# Altium schematic sheet NET & UART.SchDoc
size 393 x 281 mm
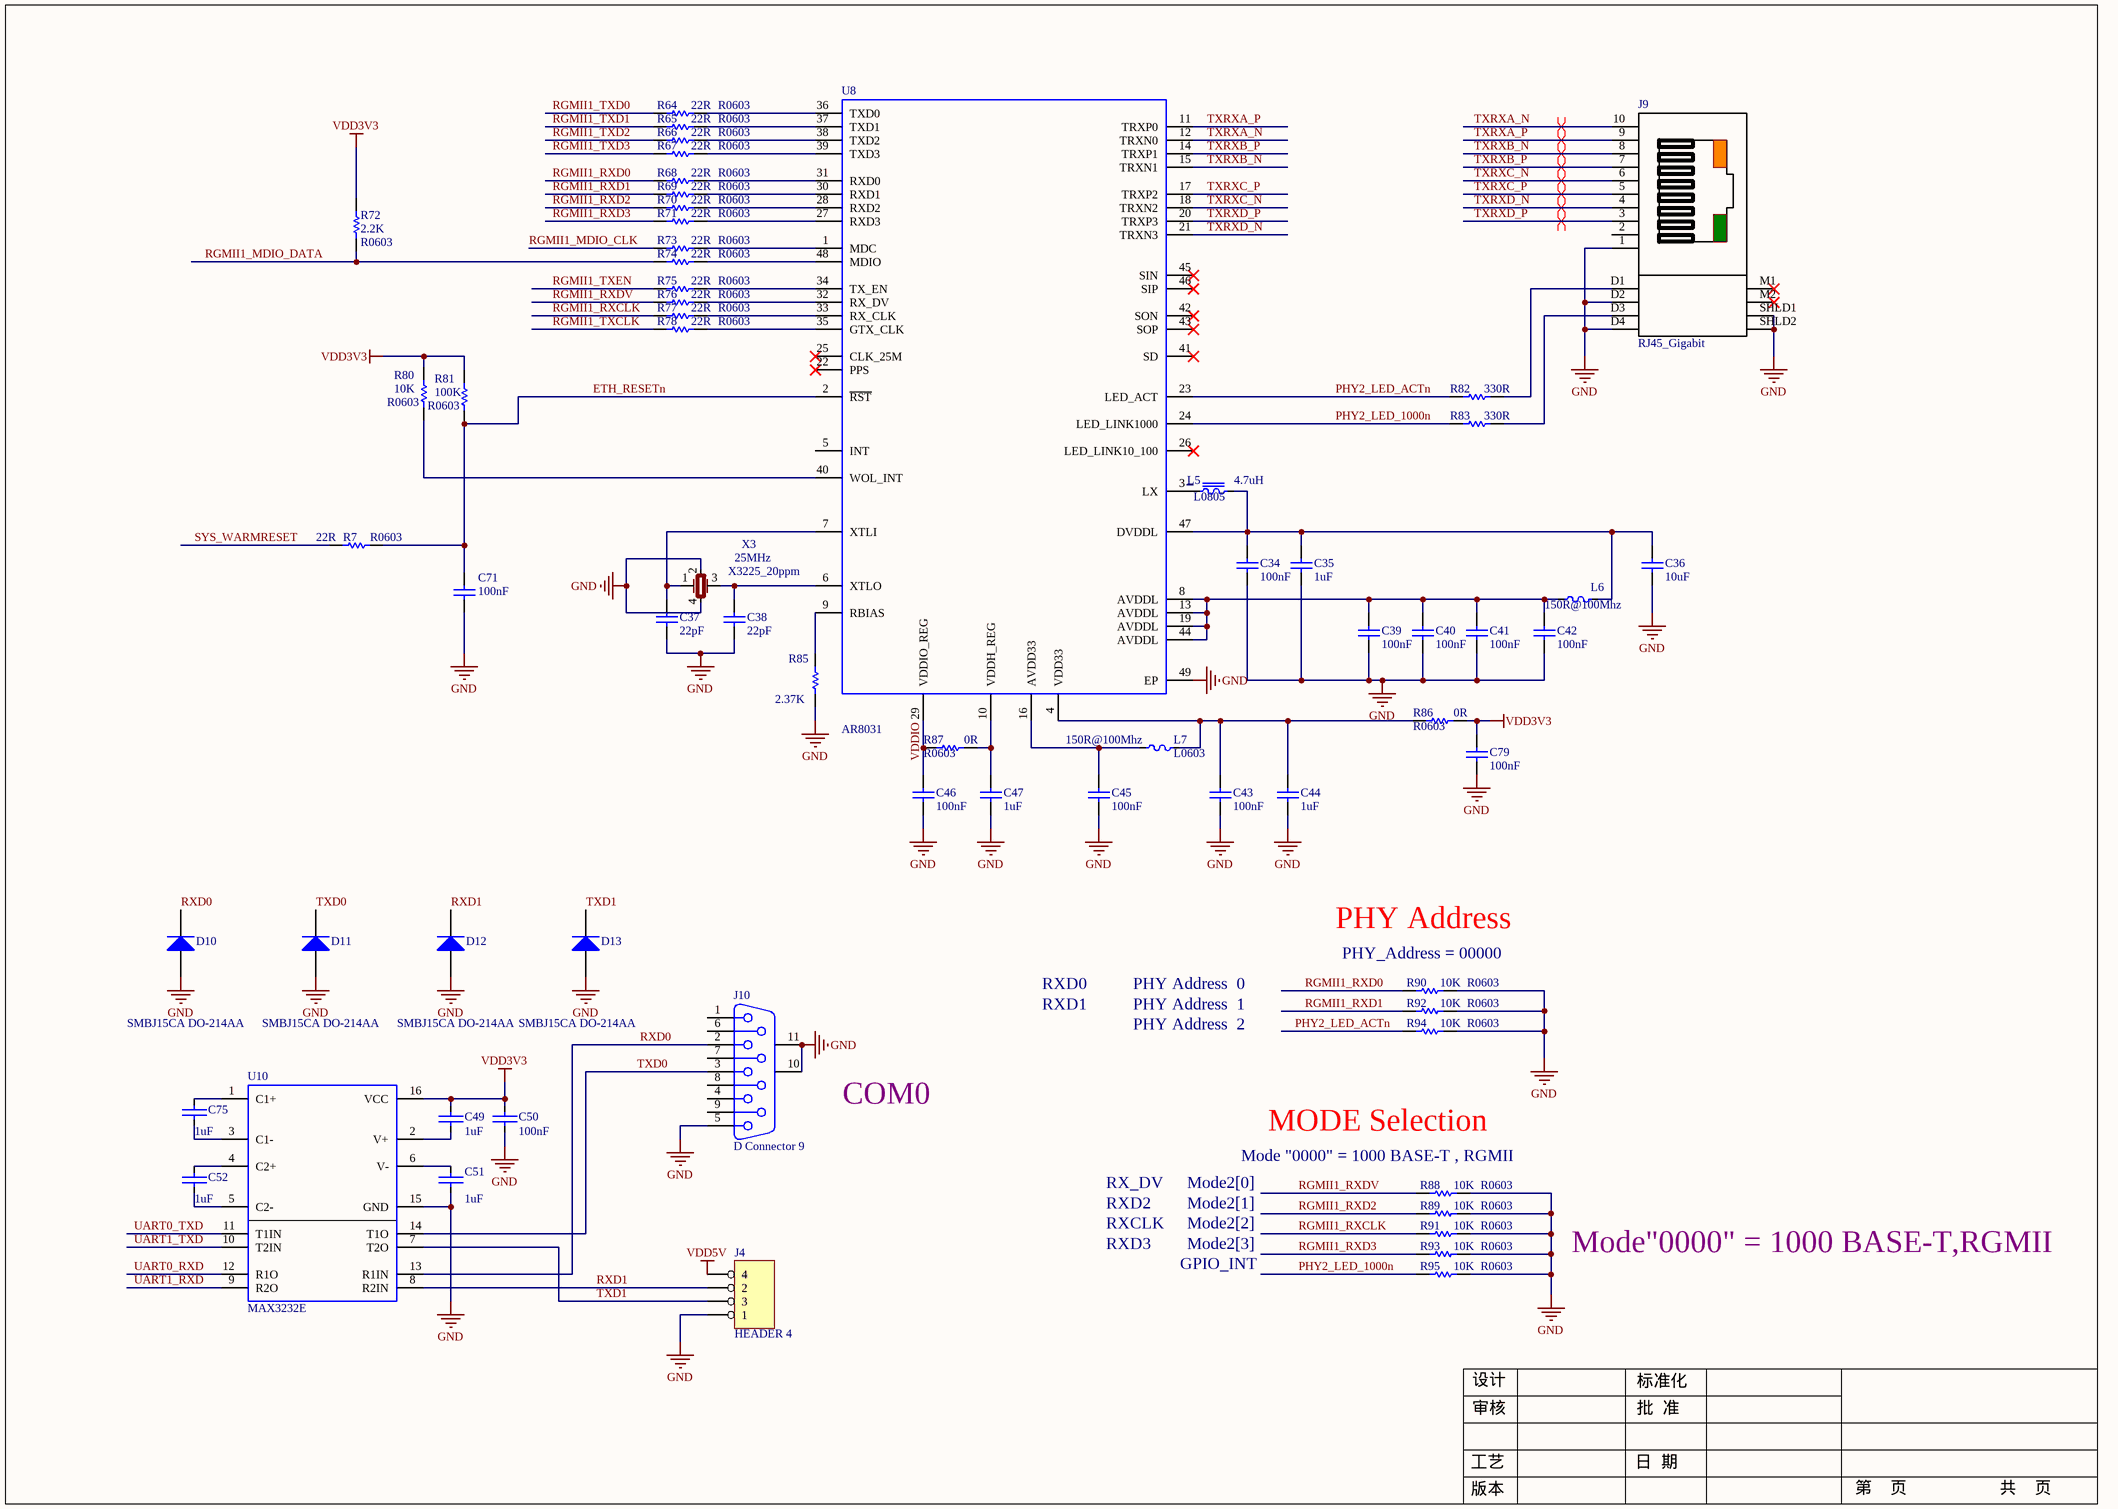
[diagram p0: NET & UART.SchDoc]

## Parts
C34  value 100nF  [C0603_M1608]  (hidden comment: C0603)
C35  value 1uF  [C0603_M1608]  (hidden comment: C0603)
C36  value 10uF  [C0603_M1608]  (hidden comment: C0603)
C37  value 22pF  [C0603_M1608]  (hidden comment: C0603)
C38  value 22pF  [C0603_M1608]  (hidden comment: C0603)
C39  value 100nF  [C0603_M1608]  (hidden comment: C0603)
C40  value 100nF  [C0603_M1608]  (hidden comment: C0603)
C41  value 100nF  [C0603_M1608]  (hidden comment: C0603)
C42  value 100nF  [C0603_M1608]  (hidden comment: C0603)
C43  value 100nF  [C0603_M1608]  (hidden comment: C0603)
C44  value 1uF  [C0603_M1608]  (hidden comment: C0603)
C45  value 100nF  [C0603_M1608]  (hidden comment: C0603)
C46  value 100nF  [C0603_M1608]  (hidden comment: C0603)
C47  value 1uF  [C0603_M1608]  (hidden comment: C0603)
C49  1uF  [C0603_M1608]
C50  100nF  [C0603_M1608]
C51  1uF  [C0603_M1608]
C52  1uF  [C0603_M1608]
C71  value 100nF  [C0603_M1608]  (hidden comment: C0603)
C75  1uF  [C0603_M1608]
C79  value 100nF  [C0603_M1608]  (hidden comment: C0603)
D10  SMBJ15CA DO-214AA  [DIODE-SK34A]
D11  SMBJ15CA DO-214AA  [DIODE-SK34A]
D12  SMBJ15CA DO-214AA  [DIODE-SK34A]
D13  SMBJ15CA DO-214AA  [DIODE-SK34A]
J4  HEADER 4  [KF2EDG-4P-3.81mm]
J9  RJ45_Gigabit  [RG45_Gagabit]
J10  D Connector 9  [DB9/M]
L5  4.7uH  value L0805  [L0805]
L6  150R@100Mhz  [L0603_M1608]
L7  150R@100Mhz  value L0603  [L0603_M1608]
R7  R0603  value 22R  [R0603_M1608]
R64  22R  value R0603  [R0603_M1608]
R65  22R  value R0603  [R0603_M1608]
R66  22R  value R0603  [R0603_M1608]
R67  22R  value R0603  [R0603_M1608]
R68  22R  value R0603  [R0603_M1608]
R69  22R  value R0603  [R0603_M1608]
R70  22R  value R0603  [R0603_M1608]
R71  22R  value R0603  [R0603_M1608]
R72  2.2K  value R0603  [R0603_M1608]
R73  22R  value R0603  [R0603_M1608]
R74  22R  value R0603  [R0603_M1608]
R75  22R  value R0603  [R0603_M1608]
R76  22R  value R0603  [R0603_M1608]
R77  22R  value R0603  [R0603_M1608]
R78  22R  value R0603  [R0603_M1608]
R80  10K  value R0603  [R0603_M1608]
R81  100K  value R0603  [R0603_M1608]
R82  330R  [R0603_M1608]
R83  330R  [R0603_M1608]
R85  2.37K  [R0603_M1608]
R86  0R  value R0603  [R0603_M1608]
R87  0R  value R0603  [R0603_M1608]
R88  10K  value R0603  [R0603_M1608]
R89  10K  value R0603  [R0603_M1608]
R90  10K  value R0603  [R0603_M1608]
R91  10K  value R0603  [R0603_M1608]
R92  10K  value R0603  [R0603_M1608]
R93  10K  value R0603  [R0603_M1608]
R94  10K  value R0603  [R0603_M1608]
R95  10K  value R0603  [R0603_M1608]
U8  AR8031  [QFN48C40P600X600_AR8031]
U10  MAX3232E  [SOIC-16N]
X3  25MHz  value X3225_20ppm  [Crystals_3225]

## Nets
GND: C34.1 C35.1 C36.1 C37.1 C38.1 C39.1 C40.1 C41.1 C42.1 C43.1 C44.1 C45.1 C46.1 C47.1 C50.2 C51.2 C71.1 C79.1 D10.1(A) D11.1(A) D12.1(A) D13.1(A) J4.1 J9.1 J9.D2 J9.D4 J9.SHLD1 J9.SHLD2 J10.5 J10.10(MH1) J10.11(MH2) R85.2 R88.1 R89.1 R90.1 R91.1 R92.1 R93.1 R94.1 R95.1 U8.49(EP) U10.15(GND) X3.2 X3.4
VDD3V3: C49.1 C50.1 C79.2 R72.1 R80.2 R81.2 R86.2 U10.16(VCC)
VDD5V: J4.4
ETH_RESETn: C71.2 R7.1 R81.1 U8.2(~{RST})
PHY2_LED_1000n: R83.1 R95.2 U8.24(LED_LINK1000)
PHY2_LED_ACTn: R82.1 R94.2 U8.23(LED_ACT)
RGMII1_MDIO_CLK: R73.2
RGMII1_MDIO_DATA: R72.2 R74.2
RGMII1_RXCLK: R77.2 R91.2
RGMII1_RXD0: R68.2 R90.2
RGMII1_RXD1: R69.2 R92.2
RGMII1_RXD2: R70.2 R89.2
RGMII1_RXD3: R71.2 R93.2
RGMII1_RXDV: R76.2 R88.2
RGMII1_TXCLK: R78.2
RGMII1_TXD0: R64.2
RGMII1_TXD1: R65.2
RGMII1_TXD2: R66.2
RGMII1_TXD3: R67.2
RGMII1_TXEN: R75.2
RXD0: D10.2(K) J10.2 U10.13(R1IN)
RXD1: D12.2(K) J4.2 U10.8(R2IN)
SYS_WARMRESET: R7.2
TXD0: D11.2(K) J10.3 U10.14(T1O)
TXD1: D13.2(K) J4.3 U10.7(T2O)
TXRXA_N: J9.10 U8.12(TRXN0)
TXRXA_P: J9.9 U8.11(TRXP0)
TXRXB_N: J9.8 U8.15(TRXN1)
TXRXB_P: J9.7 U8.14(TRXP1)
TXRXC_N: J9.6 U8.18(TRXN2)
TXRXC_P: J9.5 U8.17(TRXP2)
TXRXD_N: J9.4 U8.21(TRXN3)
TXRXD_P: J9.3 U8.20(TRXP3)
UART0_RXD: U10.12(R1O)
UART0_TXD: U10.11(T1IN)
UART1_RXD: U10.9(R2O)
UART1_TXD: U10.10(T2IN)
VDDIO: C46.2 R87.1 U8.29(VDDIO_REG)
NetC34_2: C34.2 C35.2 C36.2 L5.2 L6.1 U8.47(DVDDL)
NetC37_2: C37.2 U8.7(XTLI) X3.1
NetC38_2: C38.2 U8.6(XTLO) X3.3
NetC39_2: C39.2 C40.2 C41.2 C42.2 L6.2 U8.8(AVDDL) U8.13(AVDDL) U8.19(AVDDL) U8.44(AVDDL)
NetC43_2: C43.2 C44.2 L7.2 R86.1 U8.4(VDD33)
NetC45_2: C45.2 L7.1 U8.16(AVDD33)
NetC47_2: C47.2 R87.2 U8.10(VDDH_REG)
NetC49_2: C49.2 U10.2(V+)
NetC51_1: C51.1 U10.6(V-)
NetC52_1: C52.1 U10.4(C2+)
NetC52_2: C52.2 U10.5(C2-)
NetC75_1: C75.1 U10.1(C1+)
NetC75_2: C75.2 U10.3(C1-)
NetJ9_D1: J9.D1 R82.2
NetJ9_D3: J9.D3 R83.2
NetL5_1: L5.1 U8.3(LX)
NetR64_1: R64.1 U8.36(TXD0)
NetR65_1: R65.1 U8.37(TXD1)
NetR66_1: R66.1 U8.38(TXD2)
NetR67_1: R67.1 U8.39(TXD3)
NetR68_1: R68.1 U8.31(RXD0)
NetR69_1: R69.1 U8.30(RXD1)
NetR70_1: R70.1 U8.28(RXD2)
NetR71_1: R71.1 U8.27(RXD3)
NetR73_1: R73.1 U8.1(MDC)
NetR74_1: R74.1 U8.48(MDIO)
NetR75_1: R75.1 U8.34(TX_EN)
NetR76_1: R76.1 U8.32(RX_DV)
NetR77_1: R77.1 U8.33(RX_CLK)
NetR78_1: R78.1 U8.35(GTX_CLK)
NetR80_1: R80.1 U8.40(WOL_INT)
NetR85_1: R85.1 U8.9(RBIAS)

Not connected (* = marked no-connect by the designer): J9 2 M1* M2*; J10 1 4 6 7 8 9; U8 5(INT) 22(PPS)* 25(CLK_25M)* 26(LED_LINK10_100)* 41(SD)* 42(SON)* 43(SOP)* 45(SIN)* 46(SIP)*

## Layout directives
differential pair: TXRXA_N, TXRXA_P, TXRXB_N, TXRXB_P, TXRXC_N, TXRXC_P, TXRXD_N, TXRXD_P

## Notes on the sheet
- RXD0
- PHY Address  0
- PHY Address
- (near R90) PHY_Address = 00000
- RXD1
- PHY Address  1
- PHY Address  2
- COM0
- RX_DV
- Mode2[0]
- (near R88) Mode "0000" = 1000 BASE-T , RGMII
- MODE Selection
- RXD3
- RXD2
- RXCLK
- Mode2[1]
- Mode2[2]
- Mode2[3]
- Mode"0000" = 1000 BASE-T,RGMII
- GPIO_INT
- 设计
- 标准化
- 审核
- 批  准
- 版本
- 工艺
- 日  期
- 第    页
- 共    页

## Library data of the parts
C34-C47 C71 C79 = Cap: Capacitor; Published: 8-Jun-2000; LatestRevisionDate: 17-Jul-2002; LatestRevisionNote: Re-released for DXP Platform.; PackageReference: RAD-0.3; Publisher: Altium Limited
C49-C52 C75 = CAP_1: value: C0805
D10-D13 = Diode 1N4148: High Conductance Fast Diode; Published: 8-Jun-2000; LatestRevisionDate: 17-Jul-2002; LatestRevisionNote: Re-released for DXP Platform.; DatasheetDocument: 1997; PackageReference: DO-35; Publisher: Altium Limited; Code_JEDEC: DO-204-AH; ComponentLink1Description: Manufacturer Link; ComponentLink1URL: http://www.fairchildsemi.com/; ComponentLink2Description: Datasheet; ComponentLink2URL: http://www.fairchildsemi.com/ds/1N%2F1N4148.pdf
J4 = 4 HEADER: 4 Pin Header
J10 = D Connector 9: Receptacle Assembly, 9 Position, Right Angle; PackageDocument: O; Positions: 9; Published: 15-Jun-2001; LatestRevisionDate: 17-Jul-2002; LatestRevisionNote: Re-released for DXP Platform.; DatasheetDocument: 1-Sep-1999; PackageReference: 788750; Publisher: Altium Limited; Orientation: Right Angle; Gender: Receptacle
L5 = Inductance: 10X10_smd_5%
L6 = BEADS: Value: L0603
L7 = BEADS
R7 R64-R78 R80 R81 R86-R95 = Res1: Resistor; Published: 8-Jun-2000; LatestRevisionDate: 17-Jul-2002; LatestRevisionNote: Re-released for DXP Platform.; PackageReference: AXIAL-0.3; Publisher: Altium Limited
  R64-R78 R80 R81 R86-R95: PackageDescription: Axial Device, Thru-Hole; 2 Leads; 0.3 in Pin Spacing
R82 R83 = Res1: R0603; Published: 8-Jun-2000; LatestRevisionDate: 17-Jul-2002; LatestRevisionNote: Re-released for DXP Platform.; PackageReference: AXIAL-0.3; Publisher: Altium Limited; PackageDescription: Axial Device, Thru-Hole; 2 Leads; 0.3 in Pin Spacing; Value: R0603
R85 = Res1: Resistor; Value: R0603; Published: 8-Jun-2000; LatestRevisionDate: 17-Jul-2002; LatestRevisionNote: Re-released for DXP Platform.; PackageReference: AXIAL-0.3; Publisher: Altium Limited; PackageDescription: Axial Device, Thru-Hole; 2 Leads; 0.3 in Pin Spacing
U8 = AR8031: Atheros  10/100/1000 Gigabit Ethernet
U10 = MAX3232E: TI SOIC16
X3 = XTAL: X3225_20ppm